# Altium schematic sheet CLOCK_PLEIADES.SchDoc
size Tabloid; SheetNumber: 4; SheetTotal: 10; Sheet_Name: Insert name in Document Parameters; Size: 11x17
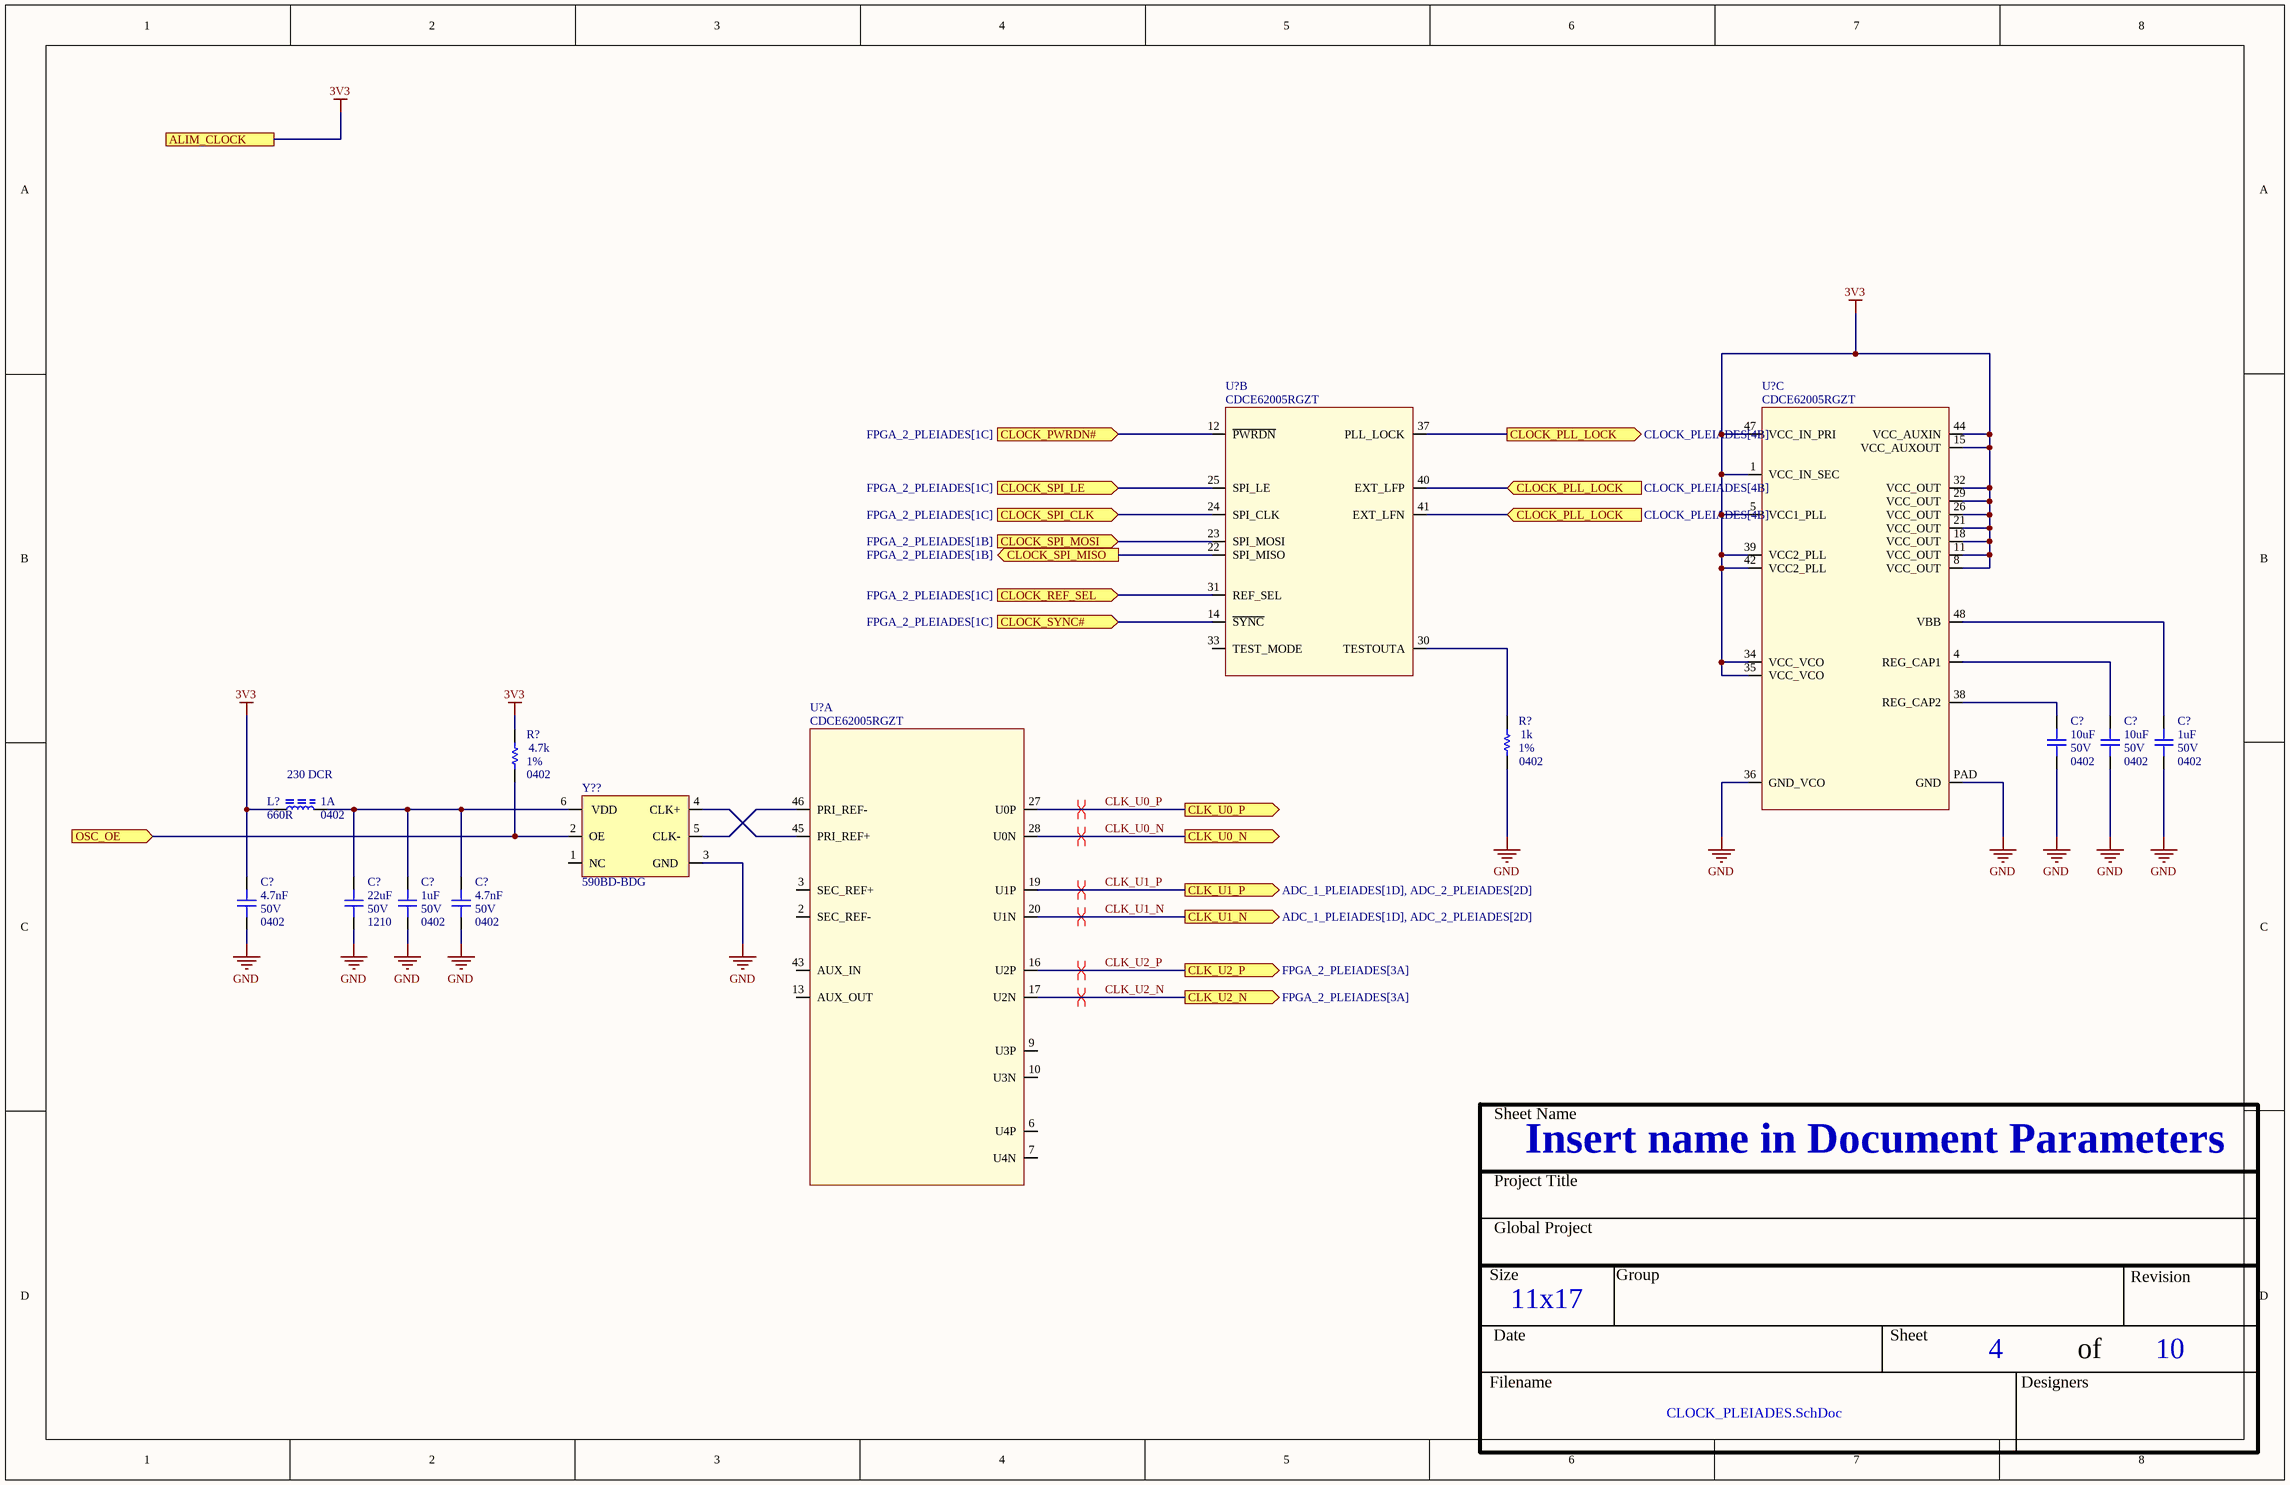
[diagram p0: CLOCK_PLEIADES.SchDoc]

## Parts
(Parts that share a designator on the sheet are numbered #1, #2 ... from top to bottom, then left to right.)
C?#1  value 10uF  Voltage: 50V  Package: 0402  [CAP_0402]  (hidden comment: CAP - 0402)
C?#2  value 10uF  Voltage: 50V  Package: 0402  [CAP_0402]  (hidden comment: CAP - 0402)
C?#3  value 1uF  Voltage: 50V  Package: 0402  [CAP_0402]  (hidden comment: CAP - 0402)
C?#4  value 4.7nF  Voltage: 50V  Package: 0402  [CAP_0402]  (hidden comment: CAP - 0402)
C?#5  value 22uF  Voltage: 50V  Package: 1210  [CAP_1210]  (hidden comment: CAP - 1210)
C?#6  value 1uF  Voltage: 50V  Package: 0402  [CAP_0402]  (hidden comment: CAP - 0402)
C?#7  value 4.7nF  Voltage: 50V  Package: 0402  [CAP_0402]  (hidden comment: CAP - 0402)
L?  value 660R  Current: 1A  Package: 0402  [FER_0402]  (hidden comment: FER - 0402)
R?#1  value 1k  Package: 0402  Precision: 1%  [RES_0402]  (hidden comment: RES - 0402)
R?#2  value 4.7k  Package: 0402  Precision: 1%  [RES_0402]  (hidden comment: RES - 0402)
U?#1  CDCE62005RGZT  [TIM_CDCE62005RGZT]  (part B of 3)
U?#2  CDCE62005RGZT  [TIM_CDCE62005RGZT]  (part C of 3)
U?#3  CDCE62005RGZT  [TIM_CDCE62005RGZT]  (part A of 3)
Y??  590BD-BDG  [OSC_590BD-BDG]

## Ports
ALIM_CLOCK, CLK_U0_N (out), CLK_U0_P (out), CLK_U1_N (out, see ADC_1_PLEIADES[1D], ADC_2_PLEIADES[2D]), CLK_U1_P (out, see ADC_1_PLEIADES[1D], ADC_2_PLEIADES[2D]), CLK_U2_N (out, see FPGA_2_PLEIADES[3A]), CLK_U2_P (out, see FPGA_2_PLEIADES[3A]), CLOCK_PLL_LOCK (in, see CLOCK_PLEIADES[4B]), CLOCK_PLL_LOCK (out, see CLOCK_PLEIADES[4B]), CLOCK_PWRDN# (in, see FPGA_2_PLEIADES[1C]), CLOCK_REF_SEL (in, see FPGA_2_PLEIADES[1C]), CLOCK_SPI_CLK (in, see FPGA_2_PLEIADES[1C]), CLOCK_SPI_LE (in, see FPGA_2_PLEIADES[1C]), CLOCK_SPI_MISO (out, see FPGA_2_PLEIADES[1B]), CLOCK_SPI_MOSI (in, see FPGA_2_PLEIADES[1B]), CLOCK_SYNC# (in, see FPGA_2_PLEIADES[1C]), OSC_OE (in)

## Nets
3V3: C?#4.2 L?.2 R?#2.2 U?#2.1(VCC_IN_SEC) U?#2.5(VCC1_PLL) U?#2.8(VCC_OUT) U?#2.11(VCC_OUT) U?#2.15(VCC_AUXOUT) U?#2.18(VCC_OUT) U?#2.21(VCC_OUT) U?#2.26(VCC_OUT) U?#2.29(VCC_OUT) U?#2.32(VCC_OUT) U?#2.34(VCC_VCO) U?#2.35(VCC_VCO) U?#2.39(VCC2_PLL) U?#2.42(VCC2_PLL) U?#2.44(VCC_AUXIN) U?#2.47(VCC_IN_PRI) ; port ALIM_CLOCK
GND: C?#1.1 C?#2.1 C?#3.1 C?#4.1 C?#5.1 C?#6.1 C?#7.1 R?#1.1 U?#2.36(GND_VCO) U?#2.PAD(GND) Y??.3(GND)
CLK_U0_N: U?#3.28(U0N) ; port CLK_U0_N
CLK_U0_P: U?#3.27(U0P) ; port CLK_U0_P
CLK_U1_N: U?#3.20(U1N) ; port CLK_U1_N
CLK_U1_P: U?#3.19(U1P) ; port CLK_U1_P
CLK_U2_N: U?#3.17(U2N) ; port CLK_U2_N
CLK_U2_P: U?#3.16(U2P) ; port CLK_U2_P
CLOCK_PLL_LOCK: U?#1.37(PLL_LOCK) U?#1.40(EXT_LFP) U?#1.41(EXT_LFN) ; port CLOCK_PLL_LOCK
CLOCK_PWRDN#: U?#1.12(~{PWRDN}) ; port CLOCK_PWRDN#
CLOCK_REF_SEL: U?#1.31(REF_SEL) ; port CLOCK_REF_SEL
CLOCK_SPI_CLK: U?#1.24(SPI_CLK) ; port CLOCK_SPI_CLK
CLOCK_SPI_LE: U?#1.25(SPI_LE) ; port CLOCK_SPI_LE
CLOCK_SPI_MISO: U?#1.22(SPI_MISO) ; port CLOCK_SPI_MISO
CLOCK_SPI_MOSI: U?#1.23(SPI_MOSI) ; port CLOCK_SPI_MOSI
CLOCK_SYNC#: U?#1.14(~{SYNC}) ; port CLOCK_SYNC#
OSC_OE: R?#2.1 Y??.2(OE) ; port OSC_OE
NetC?#1_2: C?#1.2 U?#2.38(REG_CAP2)
NetC?#2_2: C?#2.2 U?#2.4(REG_CAP1)
NetC?#3_2: C?#3.2 U?#2.48(VBB)
NetC?#5_2: C?#5.2 C?#6.2 C?#7.2 L?.1 Y??.6(VDD)
NetR?#1_2: R?#1.2 U?#1.30(TESTOUTA)
NetU?#3_45: U?#3.45(PRI_REF+) Y??.4(CLK+)
NetU?#3_46: U?#3.46(PRI_REF-) Y??.5(CLK-)

Not connected (* = marked no-connect by the designer): U?#1 33(TEST_MODE); U?#3 2(SEC_REF-) 3(SEC_REF+) 6(U4P) 7(U4N) 9(U3P) 10(U3N) 13(AUX_OUT) 43(AUX_IN); Y?? 1(NC)

## Layout directives
differential pair: CLK_U0_N, CLK_U0_P, CLK_U1_N, CLK_U1_P, CLK_U2_N, CLK_U2_P

## Notes on the sheet
- (near L?) 230 DCR
- Sheet Name
- Project Title
- Global Project
- Size
- Group
- Revision
- Date
- Sheet
- of
- Filename
- Designers

## Library data of the parts
C?#1-C?#4 C?#6 C?#7 = CAP - 0402: Precision: 10%; Current: *; CreatedBy: Jonathan Bouchard; Power: *
C?#5 = CAP - 1210: Precision: 10%; Current: *; CreatedBy: Jonathan Bouchard; Power: *
R?#1 R?#2 = RES - 0402: Voltage: 50V; Power: 1/16W; Current: *; CreatedBy: Jonathan Bouchard
U?#1-U?#3 = TIM_CDCE62005RGZT: TIM - CLK SYNTH JITTER CLEANER 3:5 - QFN-48; Voltage: 3 V ~ 3.6 V; Mfg: Texas Instruments; Current: *; Power: *; Mfg Part Number: CDCE62005RGZT; HelpURL: http://www.ti.com/lit/ds/symlink/cdce62005.pdf; CreatedBy: Jonathan Bouchard; Temperature: -40°C ~ 85°C; Value: *; Precision: *; Package: QFN-48; Supplier 1: Digikey; Supplier Part Number 1: 296-23947-1-ND
Y?? = OSC_590BD-BDG: TIM - OSC PROG 125MHz ~ 214.999MHz LVDS 3.3V 7PPM EN/DS - 6-SMD; Manufacturer #1: Silicon Labs; Current Rating: 100 mA (supply); Note: Spécifié la fréquence lors de la commande; Voltage rating: 3.3V (supply); Polarized: Yes; Value: ±7ppm (freq Stability), ±20ppm (freq stability total); Magnetic Material: UNKNOWN; GRAMS Lib Spec: 2.8; Manufacturer #2: *; Power Max: *; Part Number #1: 590BD-BDG; Part Number #2: *; HelpURL: https://www.silabs.com/documents/public/data-sheets/Si590-591.pdf; Supplier 1: Digi-Key; Supplier Part Number 1: 590BD-BDG-ND; Assembly Type: SMD; Temperature: -40°C ~ 85°C; Package: 6-SMD; CreatedBy/Date: from 590BD-CDG; Tolerance: *; VerifiedBy: Caroline Paulin / 3/10/2019; Cryo: UNKNOWN
L? = FER - 0402: Voltage: *; CreatedBy: Jonathan Bouchard; Power: *; Precision: *